# Altium schematic sheet RaspberryPi4_shield.SchDoc
size 420 x 297 mm; Address1: Address1; Address2: Address2; Address3: Address3; Address4: Address4; DocumentNumber: GROSS MBUS_80 v.1.0 usb ЭЗ; SheetNumber: 2; Scale: 1:1; DocumentType: Схема электрическая принципиальная
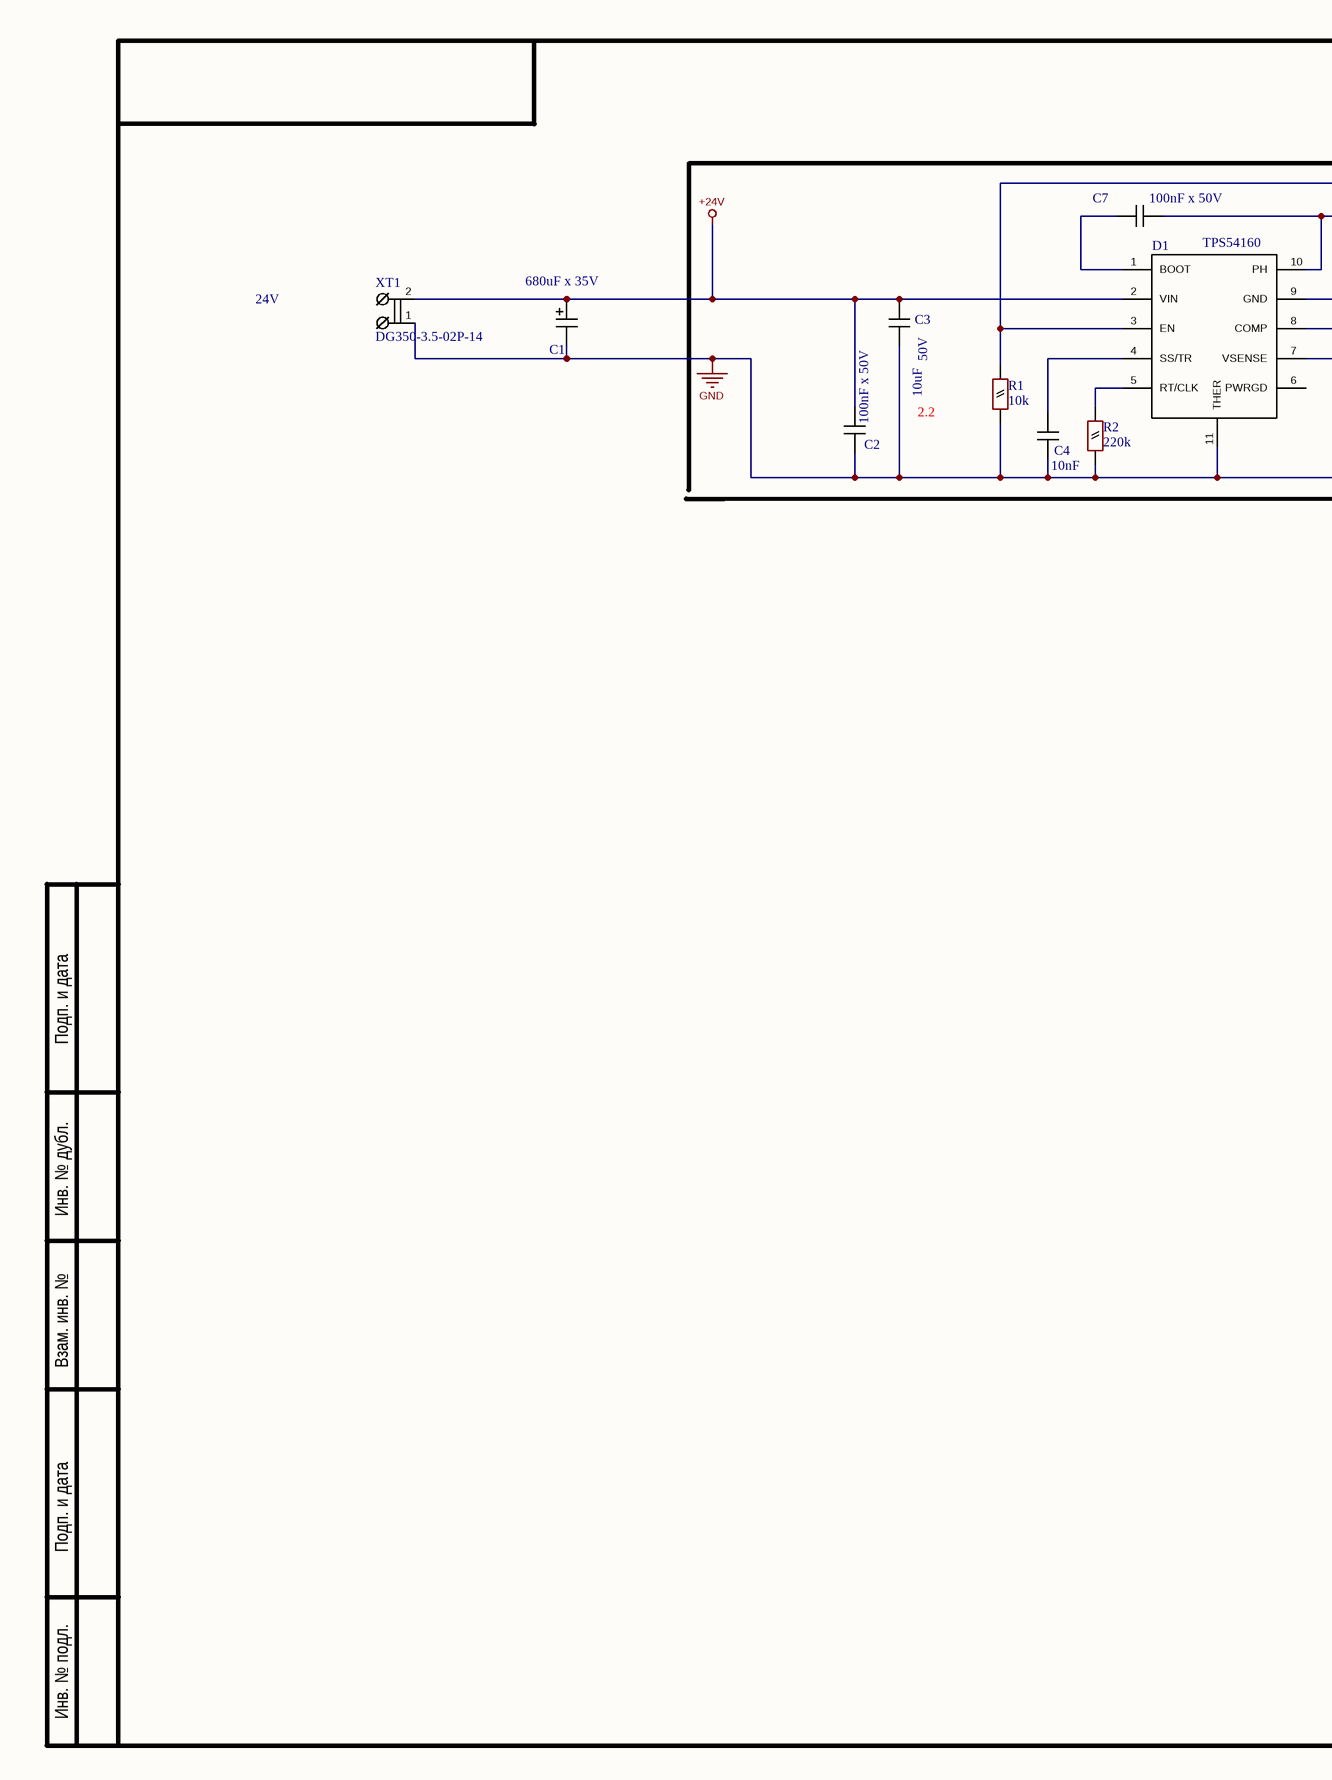
[diagram p0: RaspberryPi4_shield.SchDoc, left]
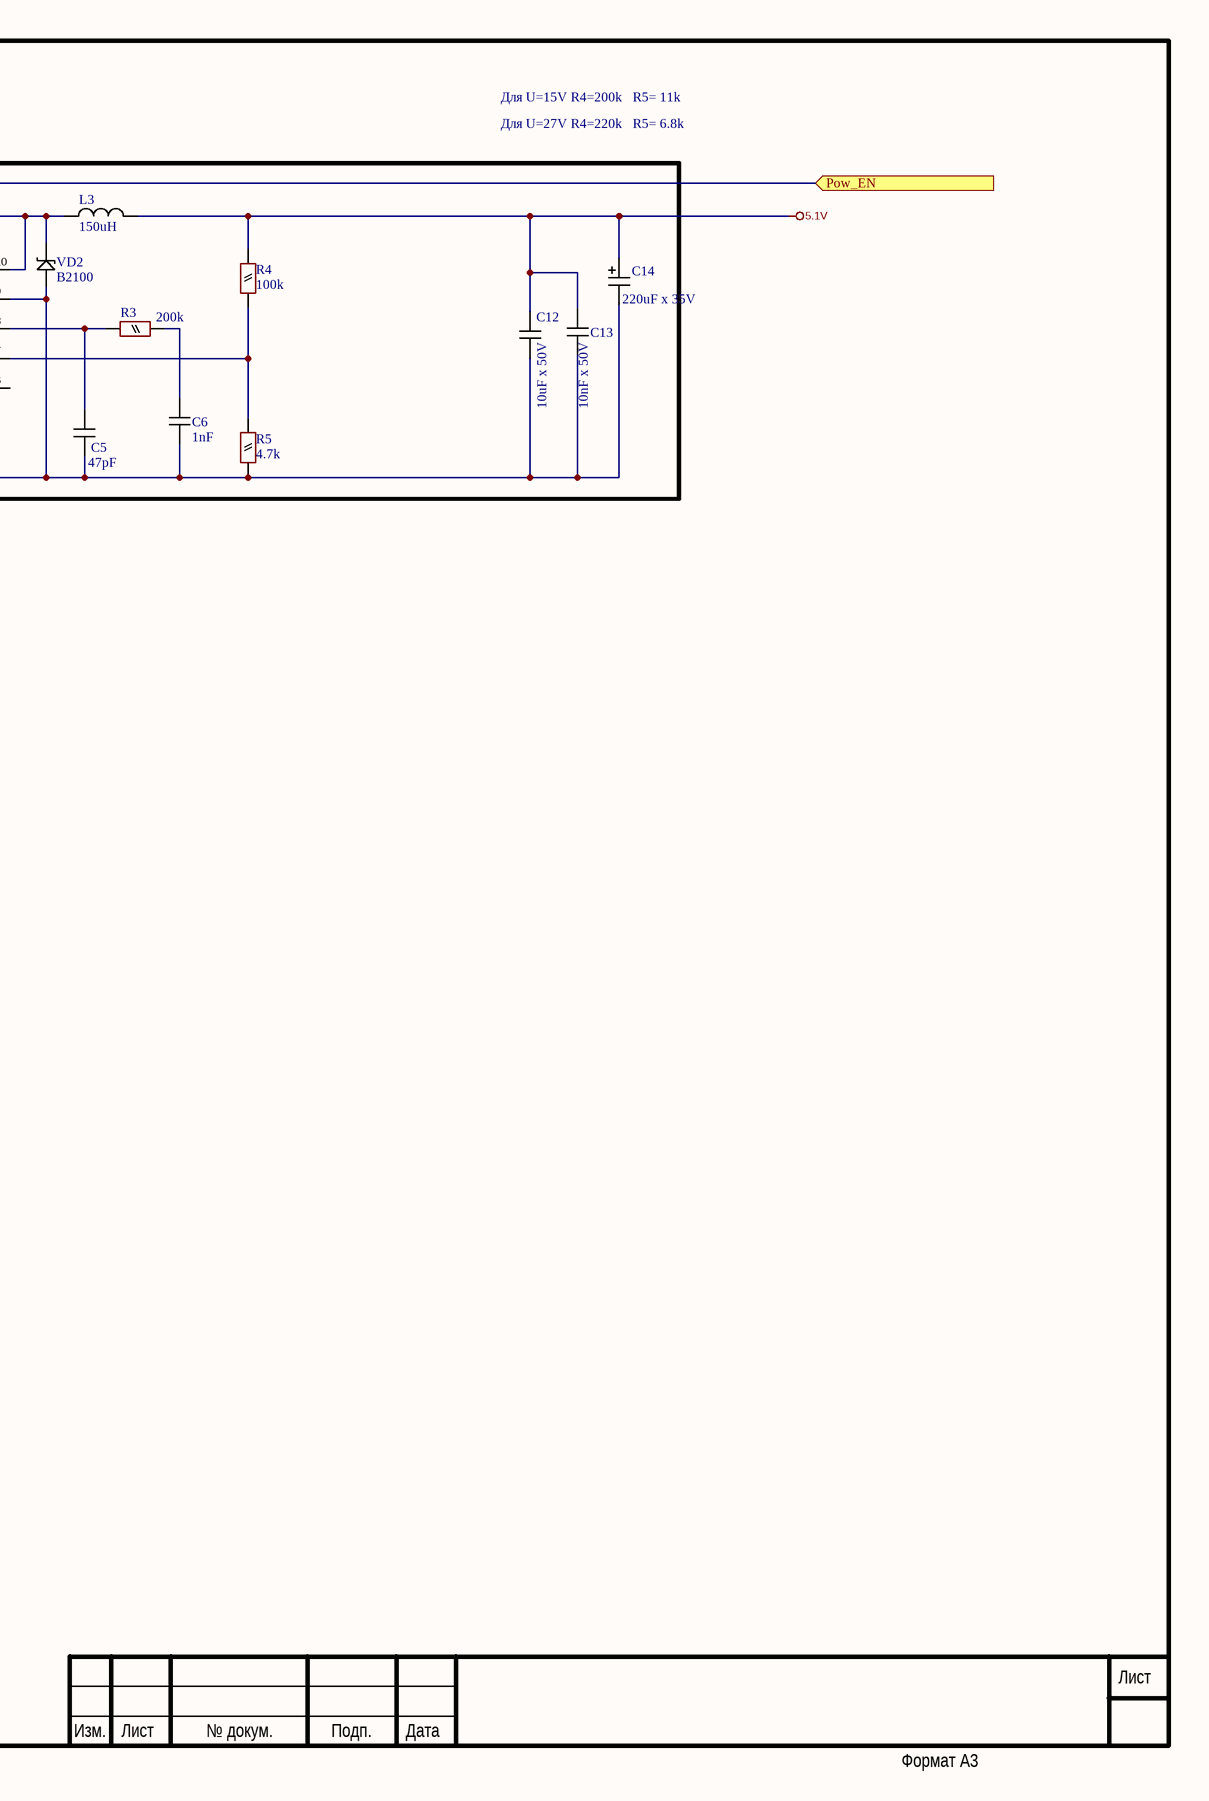
[diagram p1: RaspberryPi4_shield.SchDoc, right]

## Parts
C1  680uF x 35V  [CAP_P_DIP-10x20]
C2  value 100nF x 50V  [CAPSMD-0402]
C3  value 10uF  Power/Voltage: 50V  [CAPSMD-1206]  (hidden comment: CL31B106KBHNNNE)
C4  value 10nF  [CAPSMD-0402]
C5  value 47pF  [CAPSMD-0402]
C6  value 1nF  [CAPSMD-0402]
C7  value 100nF x 50V  [CAPSMD-0402]
C12  value 10uF x 50V  [CAPSMD-1206]
C13  value 10nF x 50V  [CAPSMD-0402]
C14  value 220uF x 35V  [CAP_P_DIP-8x12]
D1  TPS54160  [MSOP10]
L3  value 150uH  [L_Ind_smd_MSS1260]  (hidden comment: INDUCTOR)
R1  value 10k  [RESSMD-0402]
R2  value 220k  [RESSMD-0402]
R3  value 200k  [RESSMD-0402]
R4  value 100k  [RESSMD-0402]
R5  value 4.7k  [RESSMD-0402]
VD2  B2100  [SMB (CASE-403C-01)]
XT1  DG350-3.5-02P-14  [DG350-3.5-02P-14]

## Ports
Pow_EN (in)

## Nets
5.1V: C12.2 C13.2 C14.1 L3.2 R4.2
+24V: C1.1 C2.2 C3.2 D1.2(VIN) XT1.2
GND: C1.2 C2.1 C3.1 C4.1 C5.1 C6.1 C12.1 C13.1 C14.2 D1.9(GND) D1.11(THER) R1.1 R2.1 R5.1 VD2.1(A) XT1.1
Pow_EN: D1.3(EN) R1.2 ; port Pow_EN
NetC4_2: C4.2 D1.4(SS/TR)
NetC5_2: C5.2 D1.8(COMP) R3.1
NetC6_2: C6.2 R3.2
NetC7_1: C7.1 D1.10(PH) L3.1 VD2.2(C)
NetC7_2: C7.2 D1.1(BOOT)
NetD1_5: D1.5(RT/CLK) R2.2
NetD1_7: D1.7(VSENSE) R4.1 R5.2

Not connected (* = marked no-connect by the designer): D1 6(PWRGD)

## Notes on the sheet
- Для U=15V R4=200k   R5= 11k
- Для U=27V R4=220k   R5= 6.8k
- 24V
- 2.2
- Подп. и дата
- Инв. № дубл.
- Взам. инв. №
- Инв. № подл.
- Изм.
- Лист
- № докум.
- Подп.
- Дата
- Формат А3

## Library data of the parts
C1 = CAPPOL_Dip: Capasitor polar Dip; Value: 680uF x 35V
C2 C4 = CAPNPOL: Capasitor not polar; Power/Voltage: 50V; Tolerance: X7R
C3 = CAPNPOL: Capasitor not polar; Tolerance: X7R; Name: CL31B106KBHNNNE
C5-C7 C12 = CAPNPOL: Capasitor not polar; Power/Voltage: 10V; Tolerance: X7R
C13 = CAPNPOL: Capasitor not polar smd; Power/Voltage: 10V; Tolerance: X7R; Package: *
C14 = CAPPOL: Capasitor polar
D1 = TPS54260: DC/DC Contoller; ManufacturerPArtNumber: TPS54160DGQ; Name: TPS54160
L3 = INDUCTOR: Inductor in SMD package; Name: INDUCTOR
R1-R5 = RES0125: Resistor; Tolerance: 10%
VD2 = Diode Shotki: SMD Diode Shotki; Name: B2100